# Altium schematic sheet Push_Pull_Pot_Breakout.SchDoc
size A4
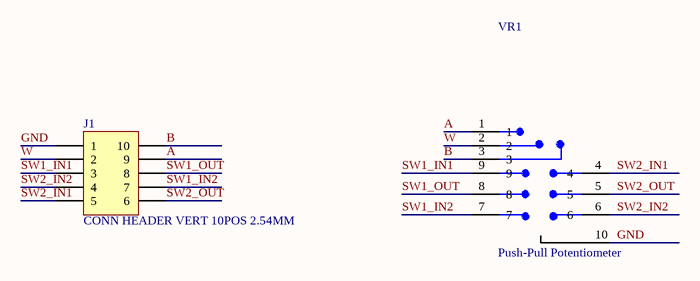
[diagram p0: Push_Pull_Pot_Breakout.SchDoc]

## Parts
J1  CONN HEADER VERT 10POS 2.54MM  [CONN HEADER VERT 10POS 2.54MM]
VR1  Push-Pull Potentiometer  [PUSH-PULL POTENTIOMETER]

## Nets
A: J1.9 VR1.1
B: J1.10 VR1.3
GND: J1.1 VR1.10
SW1_IN1: J1.3 VR1.9
SW1_IN2: J1.7 VR1.7
SW1_OUT: J1.8 VR1.8
SW2_IN1: J1.5 VR1.4
SW2_IN2: J1.4 VR1.6
SW2_OUT: J1.6 VR1.5
W: J1.2 VR1.2

## Library data of the parts
J1 = CONN HEADER VERT 10POS 2.54MM: Connector Header Through Hole 10 position 0.100" (2.54mm); Manufacturer: Samtec Inc.; Digikey Part Number: SAM8999-ND